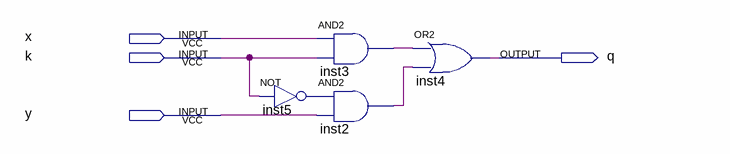
[diagram p0: schematic sheet]
// Quartus schematic xz.bdf as structural Verilog: 4 symbols, 4 pins
module xz (
  input  x,
  input  k,
  input  y,
  output q
);

  wire inst2_out, inst3_out, inst5_out;

  and inst3 (inst3_out, x, k);
  and inst2 (inst2_out, inst5_out, y);
  not inst5 (inst5_out, k);
  or inst4 (q, inst3_out, inst2_out);
endmodule
